# EAGLE design PiZeroAudio (EAGLE 9.1.3)
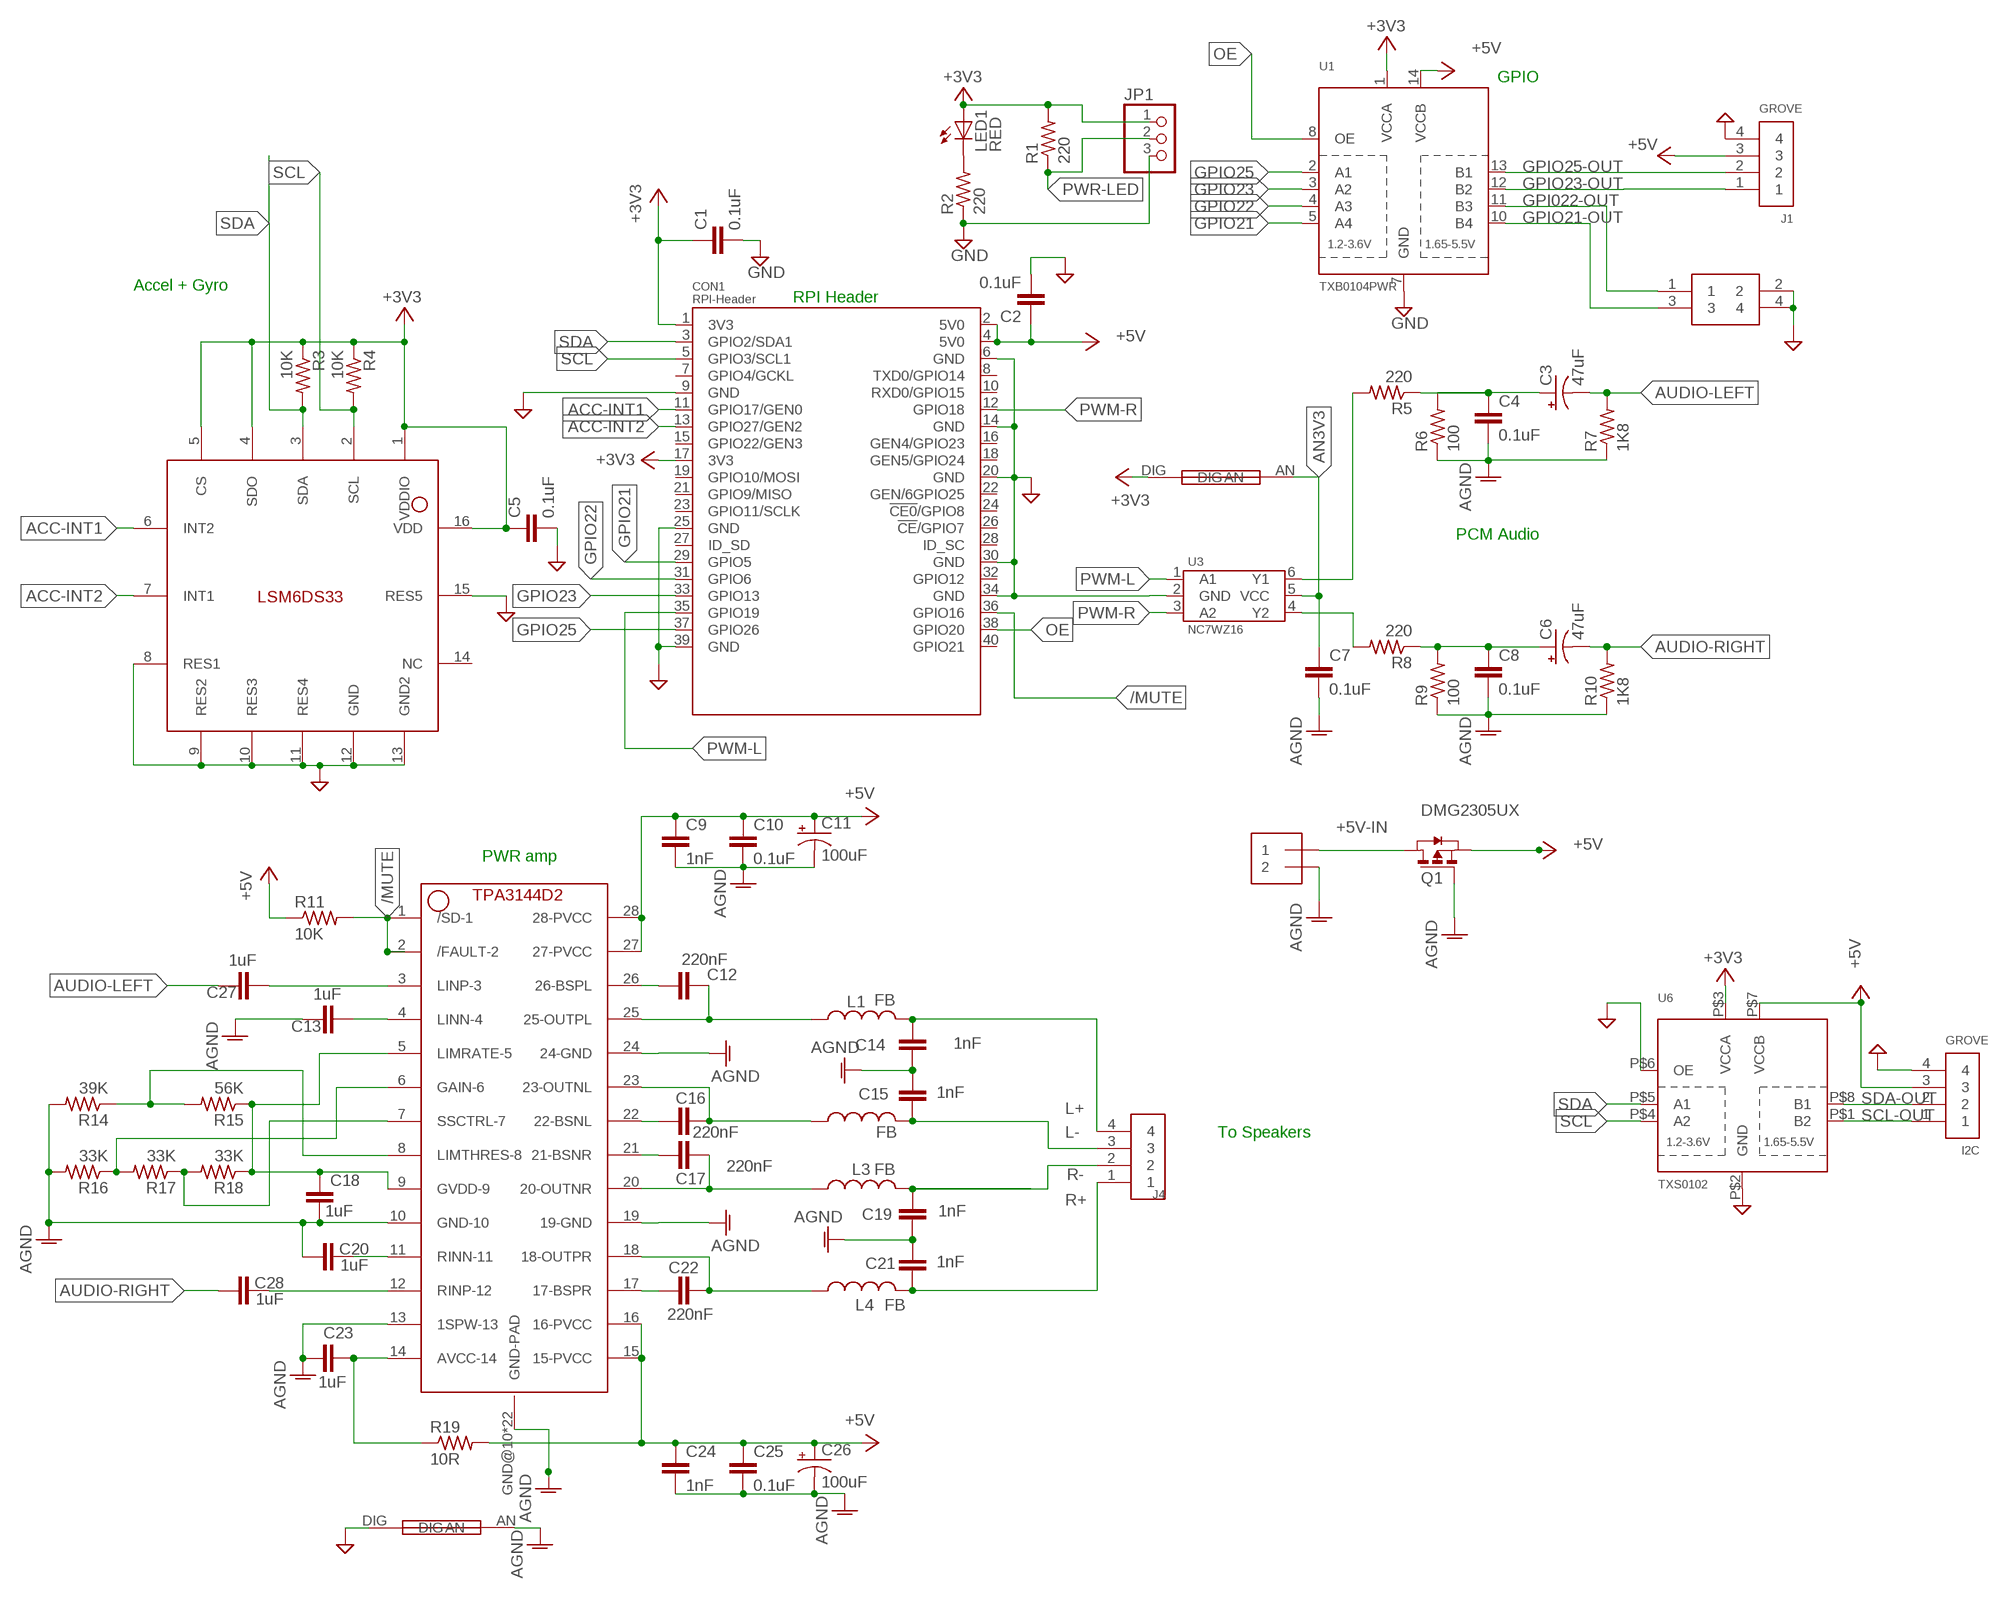
[diagram p0: schematic, sheet 1]

## Parts
C1  0.1uF  C-EUC0603  [C0603]
C2  0.1uF  C-EUC0603  [C0603]
C3  47uF  CAP-POLARISED1206-POLAR  [EIA3216]
C4  0.1uF  C-EUC0603  [C0603]
C5  0.1uF  C-EUC0603  [C0603]
C6  47uF  CAP-POLARISED1206-POLAR  [EIA3216]
C7  0.1uF  C-EUC0603  [C0603]
C8  0.1uF  C-EUC0603  [C0603]
C9  1nF  C-EUC0603  [C0603]
C10  0.1uF  C-EUC0603  [C0603]
C11  100uF  CAP-POLARISED1206-POLAR  [EIA3216]
C12  220nF  C-EUC0603  [C0603]
C13  1uF  C-EUC0603  [C0603]
C14  1nF  C-EUC0603  [C0603]
C15  1nF  C-EUC0603  [C0603]
C16  220nF  C-EUC0603  [C0603]
C17  220nF  C-EUC0603  [C0603]
C18  1uF  C-EUC0603  [C0603]
C19  1nF  C-EUC0603  [C0603]
C20  1uF  C-EUC0603  [C0603]
C21  1nF  C-EUC0603  [C0603]
C22  220nF  C-EUC0603  [C0603]
C23  1uF  C-EUC0603  [C0603]
C24  1nF  C-EUC0603  [C0603]
C25  0.1uF  C-EUC0603  [C0603]
C26  100uF  CAP-POLARISED1206-POLAR  [EIA3216]
C27  1uF  C-EUC0603  [C0603]
C28  1uF  C-EUC0603  [C0603]
CON1  RPI-Header  RPI-ZERO  [RASPBERRYPI_BASTELSTUBE_V13_RASPI_BOARD_B+_FULL]
I2C  GROVE  [JST-PH4]
J1  GROVE  [JST-PH4]
J2  2X2HEADER  [2X2]
J3  2X1-LOCKING  [22-23-2021]
J4  4X1-LOCKING  [22-23-2041]
JP1  Header 1x3  PINHD-1X3  [1X03]
L1  FB  NFZ2MSML0806  [L0806]
L2  FB  NFZ2MSML0806  [L0806]
L3  FB  NFZ2MSML0806  [L0806]
L4  FB  NFZ2MSML0806  [L0806]
LED1  RED  LEDCHIP-LED0805  [CHIP-LED0805]
Q1  DMG2305UX  [SOT23]
R1  220  R-US_R0603  [R0603]
R2  220  R-US_R0603  [R0603]
R3  10K  R-US_R0603  [R0603]
R4  10K  R-US_R0603  [R0603]
R5  220  R-US_R0603  [R0603]
R6  100  R-US_R0603  [R0603]
R7  1K8  R-US_R0603  [R0603]
R8  220  R-US_R0603  [R0603]
R9  100  R-US_R0603  [R0603]
R10  1K8  R-US_R0603  [R0603]
R11  10K  R-US_R0603  [R0603]
R14  39K  R-US_R0603  [R0603]
R15  56K  R-US_R0603  [R0603]
R16  33K  R-US_R0603  [R0603]
R17  33K  R-US_R0603  [R0603]
R18  33K  R-US_R0603  [R0603]
R19  10R  R-US_R0603  [R0603]
SH1  SHORT  [SHORT]
SH2  SHORT  [SHORT]
U1  TXB0104PWR  [TSSOP14]
U2  LSM6DS33  LSM6DS33LGA-16-3X3  [LGA-16-3X3]
U3  NC7WZ16  [SC-70-6]
U5  TPA3144D2PWPR  [HTSSOP28]
U6  TXS0102  [VFSOP-8]

## Nets
+3V3: C1.1 C5.1 CON1.1(3V3) CON1.17(3V3) JP1.1 LED1.A R1.2 R3.1 R4.1 SH1.DIG U1.1(VCCA) U2.1(VDDIO) U2.4(SDO) U2.5(CS) U2.16(VDD) U6.P$3(VCCA)
+5V: C2.1 C9.1 C10.1 C11.+ C24.1 C25.1 C26.+ CON1.2(5V0) CON1.4(5V0) I2C.3 J1.3 Q1.S R11.1 R19.2 U1.14(VCCB) U5.15(15-PVCC) U5.16(16-PVCC) U5.27(27-PVCC) U5.28(28-PVCC) U6.P$7(VCCB)
+5V-IN: J3.1 Q1.D
/MUTE: CON1.36(GPIO16) R11.2 U5.1(/SD-1) U5.2(/FAULT-2)
ACC-INT1: CON1.11(GPIO17/GEN0) U2.6(INT2)
ACC-INT2: CON1.13(GPIO27/GEN2) U2.7(INT1)
AGND: C4.2 C7.2 C8.2 C9.2 C10.2 C11.- C13.2 C14.2 C15.1 C18.2 C19.2 C20.2 C21.1 C23.2 C24.2 C25.2 C26.- J3.2 Q1.G R6.1 R7.1 R9.1 R10.1 R14.2 R16.2 SH2.AN U5.10(GND-10) U5.13(1SPW-13) U5.19(19-GND) U5.24(24-GND) U5.GND@10(GND-PAD) U5.GND@11(GND-PAD) U5.GND@12(GND-PAD) U5.GND@13(GND-PAD) U5.GND@14(GND-PAD) U5.GND@15(GND-PAD) U5.GND@16(GND-PAD) U5.GND@17(GND-PAD) U5.GND@18(GND-PAD) U5.GND@19(GND-PAD) U5.GND@20(GND-PAD) U5.GND@21(GND-PAD) U5.GND@22(GND-PAD) U5.GND@23(GND-PAD) U5.GND@24(GND-PAD) U5.GND@25(GND-PAD) U5.GND@26(GND-PAD) U5.GND@27(GND-PAD) U5.GND@28(GND-PAD) U5.GND@29(GND-PAD) U5.GND@30(GND-PAD) U5.GND@PAD(GND-PAD)
AN3V3: C7.1 SH1.AN U3.5(VCC)
AUDIO-LEFT: C3.- C27.2 R7.2
AUDIO-RIGHT: C6.- C28.2 R10.2
GND: C1.2 C2.2 C5.2 CON1.6(GND) CON1.9(GND) CON1.14(GND) CON1.20(GND) CON1.25(GND) CON1.30(GND) CON1.34(GND) CON1.39(GND) I2C.4 J1.4 J2.2 J2.4 JP1.3 R2.1 SH2.DIG U1.7(GND) U2.8(RES1) U2.9(RES2) U2.10(RES3) U2.11(RES4) U2.12(GND) U2.13(GND2) U2.15(RES5) U3.2(GND) U6.P$2(GND) U6.P$6(OE)
GPI022-OUT: J2.1 U1.11(B3)
GPIO21: CON1.29(GPIO5) U1.5(A4)
GPIO21-OUT: J2.3 U1.10(B4)
GPIO22: CON1.31(GPIO6) U1.4(A3)
GPIO23: CON1.33(GPIO13) U1.3(A2)
GPIO23-OUT: J1.1 U1.12(B2)
GPIO25: CON1.37(GPIO26) U1.2(A1)
GPIO25-OUT: J1.2 U1.13(B1)
L+: C14.1 J4.4 L1.2
L-: C15.2 J4.3 L2.2
N$1: C3.+ C4.1 R5.1 R6.2
N$2: R5.2 U3.6(Y1)
N$3: R8.2 U3.4(Y2)
N$4: C6.+ C8.1 R8.1 R9.2
N$5: C27.1 U5.3(LINP-3)
N$6: LED1.C R2.2
N$7: C13.1 U5.4(LINN-4)
N$8: C20.1 U5.11(RINN-11)
N$9: C23.1 R19.1 U5.14(AVCC-14)
N$10: C22.2 U5.17(17-BSPR)
N$11: C28.1 U5.12(RINP-12)
N$13: C17.2 U5.21(21-BSNR)
N$16: C16.2 U5.22(22-BSNL)
N$17: C12.2 U5.26(26-BSPL)
N$18: C12.1 L1.1 U5.25(25-OUTPL)
N$19: C16.1 L2.1 U5.23(23-OUTNL)
N$20: C17.1 L3.1 U5.20(20-OUTNR)
N$21: C22.1 L4.1 U5.18(18-OUTPR)
N$23: R16.1 R17.2 U5.6(GAIN-6)
N$24: R17.1 R18.2 U5.7(SSCTRL-7)
N$25: R14.1 R15.2 U5.8(LIMTHRES-8)
N$26: C18.1 R15.1 R18.1 U5.5(LIMRATE-5) U5.9(GVDD-9)
OE: CON1.38(GPIO20) U1.8(OE)
PWM-L: CON1.35(GPIO19) U3.1(A1)
PWM-R: CON1.12(GPIO18) U3.3(A2)
PWR-LED: JP1.2 R1.1
R+: C21.2 J4.1 L4.2
R-: C19.1 J4.2 L3.2
SCL: CON1.5(GPIO3/SCL1) R4.2 U2.2(SCL) U6.P$4(A2)
SCL-OUT: I2C.1 U6.P$1(B2)
SDA: CON1.3(GPIO2/SDA1) R3.2 U2.3(SDA) U6.P$5(A1)
SDA-OUT: I2C.2 U6.P$8(B1)
Unconnected: CON1.7(GPIO4/GCKL) CON1.8(TXD0/GPIO14) CON1.10(RXD0/GPIO15) CON1.15(GPIO22/GEN3) CON1.16(GEN4/GPIO23) CON1.18(GEN5/GPIO24) CON1.19(GPIO10/MOSI) CON1.21(GPIO9/MISO) CON1.22(GEN/6GPIO25) CON1.23(GPIO11/SCLK) CON1.24(!CE0!/GPIO8) CON1.26(!CE!/GPIO7) CON1.27(ID_SD) CON1.28(ID_SC) CON1.32(GPIO12) CON1.40(GPIO21) U2.14(NC)

## Notes on the sheet
- GPIO
- Accel + Gyro | RPI Header
- PCM Audio
- PWR amp
- To Speakers

## Library data of the parts
C1 C2 C4 C5 C7-C10 C12-C25 C27 C28 = rcl:C-EU: CAPACITOR, European symbol; SPICEPREFIX: C
C3 C6 C11 C26 = HappyBrackets:CAP-POLARISED: Polarised capacitor 0603 Footprint
CON1 = RPI-Zero:RPI-ZERO
I2C J1 = HappyBrackets:GROVE
J2 = HappyBrackets:2X2HEADER: 2x2 2.54mm header
J3 = HappyBrackets:2X1-LOCKING: 2x1 Locking Header https://www.molex.com/pdm_docs/sd/022272021_sd.pdf
J4 = HappyBrackets:4X1-LOCKING
JP1 = adafruit:PINHD-1X3: PIN HEADER
L1-L4 = HappyBrackets:NFZ2MSM: Ferrite Bead https://www.digikey.com.au/product-detail/en/murata-electronics-north-america/NFZ2MSM301SN10L/490-14481-1-ND/6606942
LED1 = adafruit:LED: LED OSRAM: - CHIPLED LG R971, LG N971, LY N971, LG Q971, LY Q971, LO R971, LY R971 LH N974, LH R974 LS Q976, LO Q976, LY Q976 LO Q996 - Hyper CHIPLED LW Q18S LB Q993, LB Q99A, LB R99A - SideLED LS A670, LO A670, LY A670, LG A670, LP A670 LB A673, LV A673, LT A673, LW A673 LH A674 LY A675 LS A676, LA A676, LO A676, LY A676, LW A676 LS A679, LY A679, LG A679 - Hyper Micro SIDELED® LS Y876, LA Y876, LO Y876, LY Y876 LT Y87S - SmartLED LW L88C, LW L88S LB L89C, LB L89S, LG L890 LS L89K, LO L89K, LY L89K LS L896, LA L896, LO L896, LY L896 - TOPLED LS T670, LO T670, LY T670, LG T670, LP T670 LSG T670, LSP T670, LSY T670, LOP T670, LYG T670 LG T671, LOG T671, LSG T671 LB T673, LV T673, LT T673, LW T673 LH T674 LS T676, LA T676, LO T676, LY T676, LB T676, LH T676, LSB T676, LW T676 LB T67C, LV T67C, LT T67C, LS T67K, LO T67K, LY T67K, LW E67C LS E67B, LA E67B, LO E67B, LY E67B, LB E67C, LV E67C, LT E67C LW T67C LS T679, LY T679, LG T679 LS T770, LO T770, LY T770, LG T770, LP T770 LB T773, LV T773, LT T773, LW T773 LH T774 LS E675, LA E675, LY E675, LS T675 LS T776, LA T776, LO T776, LY T776, LB T776 LHGB T686 LT T68C, LB T68C - Hyper Mini TOPLED® LB M676 - Mini TOPLED Santana® LG M470 LS M47K, LO M47K, LY M47K Source: http://www.osram.convergy.de/
Q1 = HappyBrackets:DMG2305UX: P-CHANNEL ENHANCEMENT MODE MOSFET This MOSFET is designed to minimize the on-state resistance (RDS(ON)), yet maintain superior switching performance, making it ideal for high efficiency power management applications.
R1-R11 R14-R19 = adafruit:R-US_: RESISTOR, American symbol
SH1 SH2 = HappyBrackets:SHORT: Creates a short so analogue and digital power can have different net names. You will need to approve DRC error checks to use this
U1 = adafruit:TXB0104PWR: 4-Bit Bi-Directional Level Shifter 1.2V-3.6V (VCCA) to 1.65V-5.5V (VCCB) bi-directional level shifter with auto direction sensing. Max data rate - VCCA 1.8V: 20Mbps (50ns), VCCA 3.3V: 100Mbps (10ns) Digikey: 296-21929-1-ND
U2 = HappyBrackets:LSM6DS33: iNEMO inertial module: always-on 3D accelerometer and 3D gyroscope
U3 = fairchild:NC7WZ16
U5 = HappyBrackets:TPA3144D2PWPR: TPA3144D2PWPR 6-W Inductor Free Stereo (BTL) Class-D Audio Amplifier with Ultra Low EMI and AGL
U6 = adafruit:TXS0102: 2-Bit Bi-Directional Level Shifter (I2C, etc.) Designed for I2C devices and has internal pullups. Not to be confused with TXB010x series. 1.2V-3.6V (VCCA) to 1.65V-5.5V (VCCB) bi-directional level shifter with auto direction sensing. Max data rate - 24Mbps (Push Pull), 2Mbps (Open Drain) Digikey: 296-21931-1-ND

## Net classes
0 default: width 0.152 mm, clearance 0.152 mm
2 PWM-LEFT: width 0.305 mm, drill 0.508 mm, clearance 0.508 mm
3 PWM-RIGHT: width 0.305 mm, drill 0.508 mm, clearance 0.508 mm
4 AUDIO-L: width 0.305 mm, drill 0.508 mm, clearance 0.508 mm
5 AUDIO-R: width 0.305 mm, drill 0.508 mm, clearance 0.508 mm
6 +5V: width 0.508 mm, drill 0.508 mm, clearance 0.254 mm

## Board
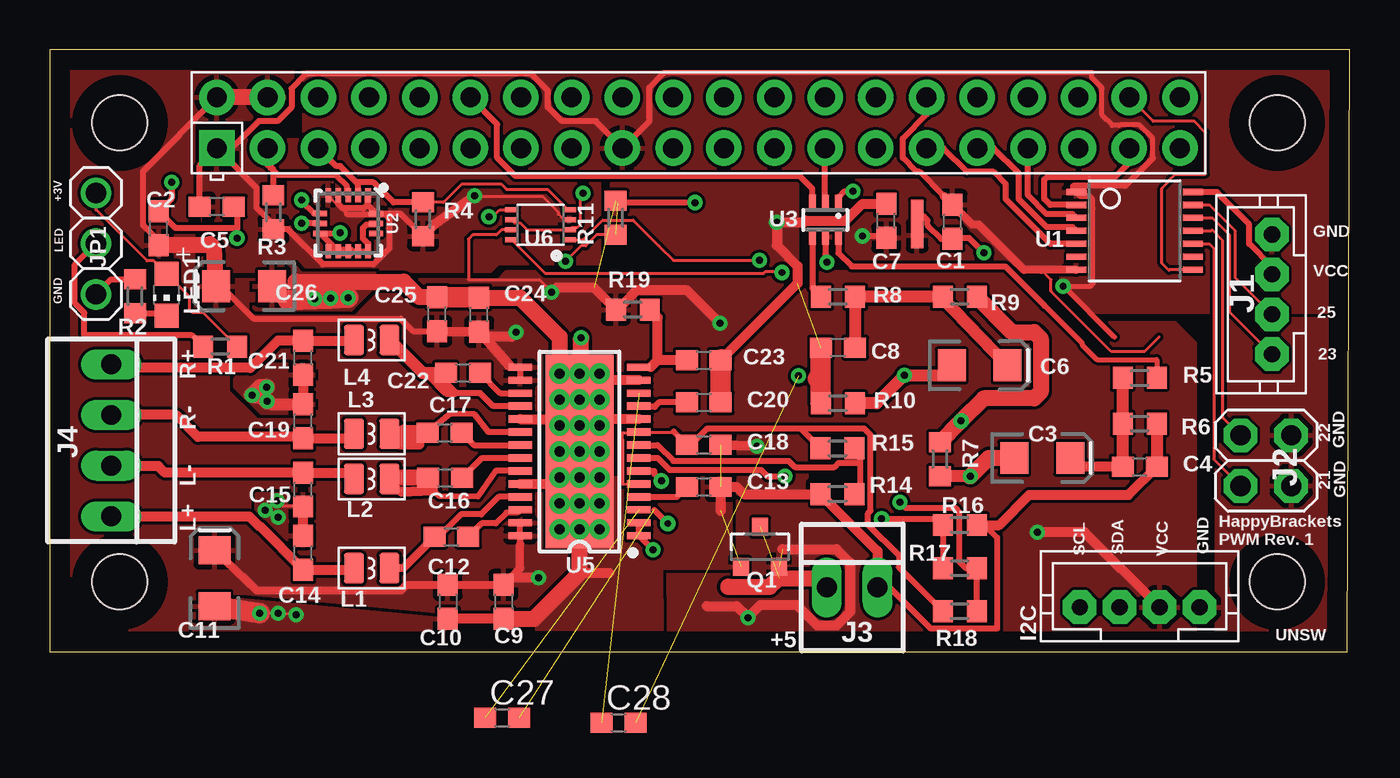
[diagram p1: board, top side]
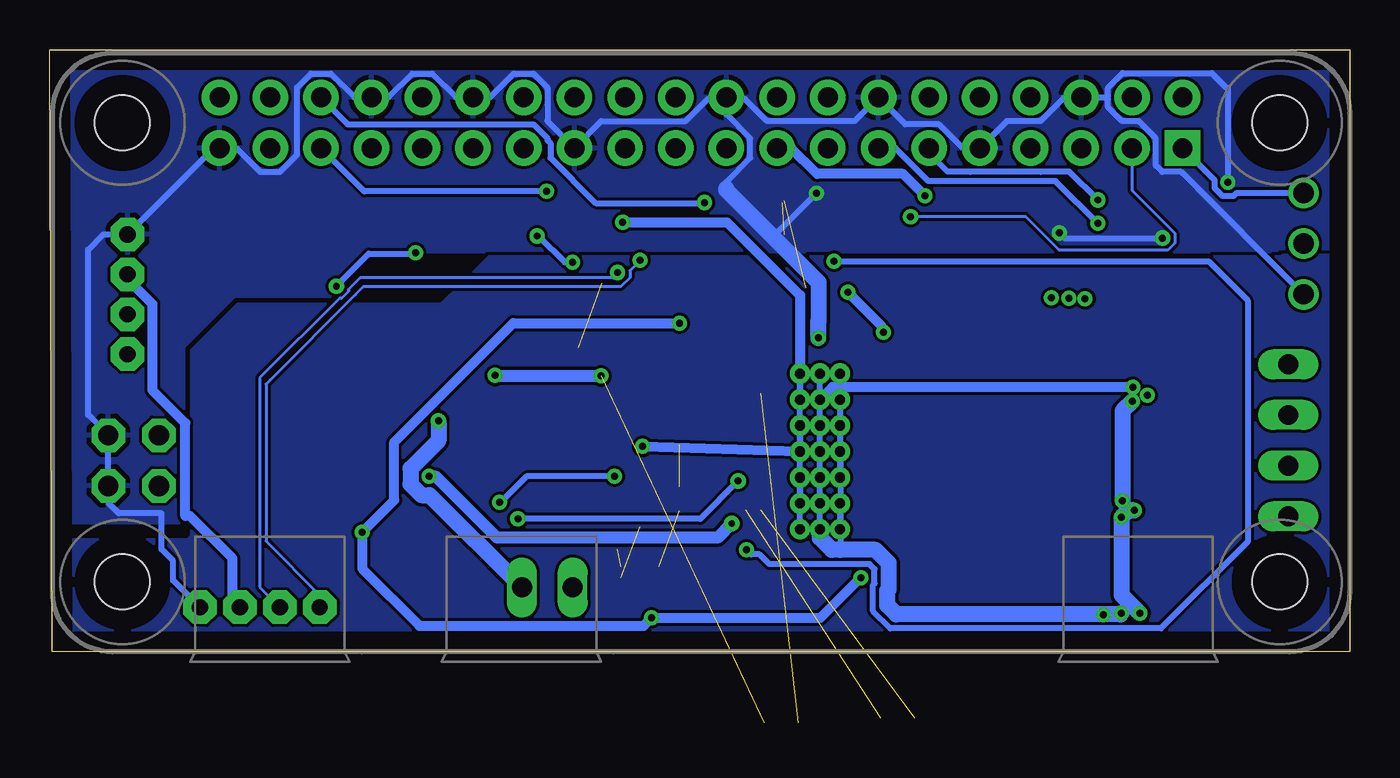
[diagram p2: board, bottom side, seen from below]

Size 65.13 x 30.15 mm. Coordinates in mm from the lower left corner, seen from the top.
Outline: 0,0 65.02,0 65.13,30.15 0,30.15 0,0
Copper layers (1*16): Top 0.035mm / dielectric 1.5mm / Bottom 0.035mm
Design rules "default": minimum track width 6mil, minimum drill 0.35mm, track to track 6mil, track to pad 6mil, pad to pad 6mil, via to via 6mil, smd to smd 6mil, copper to edge 40mil, drill to drill 6mil, minimum pad ring 10mil, minimum via ring 8mil, stop-mask expansion 4mil, vias tented up to drill 0mil, thermal gap 10mil

### Footprints (pad centres in the part's own frame; a part is rotated, then mirrored left to right if it is on the bottom)
C0603 = smd 1.1 x 1: 1 -0.85,0; 2 0.85,0
EIA3216 = smd 1.4 x 1.6: + 1.4,0; - -1.4,0
RASPBERRYPI_BASTELSTUBE_V13_RASPI_BOARD_B+_FULL = drill 1 pad 1.778 square: 1 8.37,25.23 | drill 1 pad 1.778: 2 8.37,27.77; 3 10.91,25.23; 4 10.91,27.77; 5 13.45,25.23; 6 13.45,27.77; 7 15.99,25.23; 8 15.99,27.77; 9 18.53,25.23; 10 18.53,27.77; 11 21.07,25.23; 12 21.07,27.77; 13 23.61,25.23; 14 23.61,27.77; 15 26.15,25.23; 16 26.15,27.77; 17 28.69,25.23; 18 28.69,27.77; 19 31.23,25.23; 20 31.23,27.77; 21 33.77,25.23; 22 33.77,27.77; 23 36.31,25.23; 24 36.31,27.77; 25 38.85,25.23; 26 38.85,27.77; 27 41.39,25.23; 28 41.39,27.77; 29 43.93,25.23; 30 43.93,27.77; 31 46.47,25.23; 32 46.47,27.77; 33 49.01,25.23; 34 49.01,27.77; 35 51.55,25.23; 36 51.55,27.77; 37 54.09,25.23; 38 54.09,27.77; 39 56.63,25.23; 40 56.63,27.77 | hole 2.75: 3.5,3.5; 3.5,26.5; 61.5,3.5; 61.5,26.5
JST-PH4 = drill 0.813 pad 1.676 octagon: 1 -3,0; 2 -1,0; 3 1,0; 4 3,0
2X2 = drill 1.016 pad 1.676 octagon: 1 -3.81,-1.27; 2 -3.81,1.27; 3 -1.27,-1.27; 4 -1.27,1.27
22-23-2021 = drill 1 long: 1 -1.27,0; 2 1.27,0
22-23-2041 = drill 1 long: 1 -3.81,0; 2 -1.27,0; 3 1.27,0; 4 3.81,0
1X03 = drill 1.016: 1 -2.54,0; 2 0,0; 3 2.54,0
L0806 = smd 1.016 x 1.524: 1 -0.889,0; 2 0.889,0
CHIP-LED0805 = smd 1.2 x 1.2: A 0,-1.05; C 0,1.05
SOT23 = smd 0.8 x 0.9: D 0,1; G -0.95,-1; S 0.95,-1
R0603 = smd 1 x 1.1: 1 -0.85,0; 2 0.85,0
SHORT = smd 1.27 x 0.635: AN -0.635,0; DIG 0.508,0
TSSOP14 = smd 0.305 x 0.991: 1 -1.95,-2.918; 2 -1.3,-2.918; 3 -0.65,-2.918; 4 0,-2.918; 5 0.65,-2.918; 6 1.3,-2.918; 7 1.95,-2.918; 8 1.95,2.918; 9 1.3,2.918; 10 0.65,2.918; 11 0,2.918; 12 -0.65,2.918; 13 -1.3,2.918; 14 -1.95,2.918
LGA-16-3X3 = smd 0.7 x 0.28: 1 -1.4,1; 2 -1.4,0.5; 3 -1.4,0; 4 -1.4,-0.5; 5 -1.4,-1; 9 1.4,-1; 10 1.4,-0.5; 11 1.4,0; 12 1.4,0.5; 13 1.4,1 | smd 0.28 x 0.7: 6 -0.5,-1.4; 7 0,-1.4; 8 0.5,-1.4; 14 0.5,1.4; 15 0,1.4; 16 -0.5,1.4
SC-70-6 = smd 0.8 x 0.35: 1 -0.85,0.65; 2 -0.85,0; 3 -0.85,-0.65; 4 0.85,-0.65; 5 0.85,0; 6 0.85,0.65
HTSSOP28 = smd 0.36 x 1.19: 1 -4.225,-2.97; 2 -3.575,-2.97; 3 -2.925,-2.97; 4 -2.275,-2.97; 5 -1.625,-2.97; 6 -0.975,-2.97; 7 -0.325,-2.97; 8 0.325,-2.97; 9 0.975,-2.97; 10 1.625,-2.97; 11 2.275,-2.97; 12 2.925,-2.97; 13 3.575,-2.97; 14 4.225,-2.97; 15 4.225,2.97; 16 3.575,2.97; 17 2.925,2.97; 18 2.275,2.97; 19 1.625,2.97; 20 0.975,2.97; 21 0.325,2.97; 22 -0.325,2.97; 23 -0.975,2.97; 24 -1.625,2.97; 25 -2.275,2.97; 26 -2.925,2.97; 27 -3.575,2.97; 28 -4.225,2.97 | drill 0.508: GND@10 -3.9,1; GND@11 -3.9,0; GND@12 -3.9,-1; GND@13 -2.6,-1; GND@14 -2.6,0; GND@15 -2.6,1; GND@16 -1.3,1; GND@17 -1.3,0; GND@18 -1.3,-1; GND@19 0,-1; GND@20 0,0; GND@21 0,1; GND@22 1.3,1; GND@23 1.3,0; GND@24 1.3,-1; GND@25 2.6,-1; GND@26 2.6,0; GND@27 2.6,1; GND@28 3.9,1; GND@29 3.9,0; GND@30 3.9,-1 | smd 9.7 x 3.4: GND@PAD 0,0
VFSOP-8 = smd 0.25 x 0.65: P$1 -0.75,-1.45; P$2 -0.25,-1.45; P$3 0.25,-1.45; P$4 0.75,-1.45; P$5 0.75,1.45; P$6 0.25,1.45; P$7 -0.25,1.45; P$8 -0.75,1.45

### Placement (x,y rotation side)
C1  45.24,21.54 90 top
C2  5.46,21.21 90 top
C3  49.73,9.71 0 top
C4  54.61,9.27 0 top
C5  8.36,22.3 0 top
C6  46.59,14.35 0 top
C7  41.91,21.59 90 top
C8  39.5,15.24 180 top
C9  22.73,2.5 270 top
C10  19.94,2.5 270 top
C11  8.25,3.68 90 top
C12  20.12,5.77 0 top
C13  32.77,8.26 0 top
C14  12.7,4.95 90 top
C15  12.7,8.13 90 top
C16  19.81,8.71 0 top
C17  19.79,10.97 0 top
C18  32.77,10.37 0 top
C19  12.7,11.56 90 top
C20  32.77,12.49 0 top
C21  12.7,14.73 90 top
C22  20.7,13.97 0 top
C23  32.77,14.6 0 top
C24  21.51,16.89 90 top
C25  19.41,16.92 90 top
C26  9.73,18.31 180 top
C27  22.66,-3.3 0 top  (outside the outline)
C28  28.5,-3.56 0 top  (outside the outline)
CON1  0,0 0 top
I2C  54.61,2.24 0 top
J1  61.24,17.91 90 top
J2  60.93,7.04 270 top
J3  40.21,3.23 0 top
J4  3.07,10.59 270 top
JP1  2.31,20.45 270 top
L1  16.13,4.19 180 top
L2  16.13,8.66 180 top
L3  16.13,10.92 180 top
L4  16.13,15.62 180 top
LED1  5.84,17.88 180 top
Q1  35.59,5.26 0 top
R1  8.53,15.29 0 top
R2  4.27,17.81 270 top
R3  11.2,22.02 90 top
R4  18.69,21.67 90 top
R5  54.61,13.72 0 top
R6  54.61,11.43 180 top
R7  44.6,9.65 270 top
R8  39.5,17.78 180 top
R9  45.59,17.78 180 top
R10  39.5,12.45 0 top
R11  28.35,21.74 270 top
R14  39.47,7.9 180 top
R15  39.47,10.19 0 top
R16  45.59,6.35 0 top
R17  45.59,4.19 180 top
R18  45.59,2.03 0 top
R19  29.21,17.14 180 top
SH1  43.46,21.49 90 top
SH2  26.49,13.84 90 top
U1  54.36,21.08 270 top
U2  14.95,21.46 270 top
U3  38.86,21.64 270 top
U5  26.54,10.03 90 top
U6  24.59,21.39 90 top

### Tracks (layer width: path | path; a pad name or v marks a point on that pad's centre or on a via)
+3V3  (via drill 0.35)
  Top 0.152: U2.5 14.36,22.45 14.43,22.45 | U2.4 14.45,22.36 14.89,21.92 | R1.2 7.69,16.98 7.13,16.98 7,17.12 7,17.78 LED1.A 5.19,19.58 4.87,19.58 2.31,22.14 JP1.1 | v21.28,22.84 21.31,22.81 24.69,22.81 25.48,22.01 25.48,21.92 25.76,21.64 U6.P$3
  Top 0.254: v50.77,18.31 50.8,18.31 | 50.8,18.31 52.15,18.31 52.27,18.44 52.27,22.2 52.24,22.23 | 53.35,15.76 50.8,18.31 | 55.28,24.74 55.26,24.76 55.26,25.71 54.57,26.4 53.61,26.4 53.57,26.37 53.24,26.37 52.72,26.89 52.72,28.25 52.22,28.75 52.22,29.01 30.78,29.01 30.74,28.96
  Top 0.305: 14.43,22.45 14.68,22.21 15.71,22.21 15.9,22.4 15.9,22.82 U2.1 15.95,22.36 U2.16 17.55,21.96 R4.1 | C5.1 7.51,24.37 CON1.1 8.51,25.09 | 8.51,25.09 10.35,23.25 10.35,22.25 11.2,21.39 R3.1 11.92,21.17 13.68,19.41 16.21,19.41 17,20.2 17,21.73 16.81,21.92 14.89,21.92 | 52.24,22.23 52.24,22.66 52.06,22.84 51.63,22.84 U1.1 51.28,23.19 51.28,23.34 53.89,23.34 55.28,24.74 | v46.81,19.99 46.07,20.73 45.27,20.73 | 8.51,25.09 8.99,25.09 10.47,26.58 11.4,26.58 12.1,27.28 12.1,28.21 12.83,28.93 12.92,28.93 12.96,28.96 24.1,28.96 24.96,28.11 24.96,27.28 25.66,26.58 27.34,26.58 CON1.17 30.04,26.58 30.04,28.26 30.74,28.96 | C1.1 45.27,20.73 | 45.27,20.73 C1.1 | C1.1 44.66,20.69 43.98,21.37 43.98,21.62 43.8,21.79 43.66,21.79 SH1.DIG | 14.43,22.45
  Top 0.508: v21.28,22.84 19.31,21.44 R4.1
  Bottom 0.305: v50.77,18.31 49.15,19.94 46.81,19.94 v46.81,19.99 | CON1.1 6.78,23.64 6.78,23.24 6.38,22.84 5.81,22.84 5.66,22.99 JP1.1
  Bottom 0.508: v21.28,22.84 22.38,23.93 26.69,23.93 27.98,25.23 CON1.17
  pour Top: 12.7,30.48 12.7,24.13 58.42,24.13 58.42,29.21 58.42,30.48 13.97,30.48
  pour Top (rank 2): 7.62,25.4 7.62,19.05 22.1,19.05 22.48,19.43 27.56,19.43 27.56,25.15 27.05,25.65 7.87,25.65
  pour Top (rank 2): 48.13,29.97 48.13,23.11 47.62,22.61 47.62,20.07 47.88,19.81 49.53,19.81 52.32,17.02 65.28,17.02 65.91,17.65 65.91,30.23 65.53,30.61 48.39,30.61 48.26,30.48
+5V  (via drill 0.35)  (2 unrouted)
  Top 0.152: U6.P$7 22.63,21.14 22.37,20.88 21.19,20.88 20.98,20.68 20.98,18.64 24.54,18.64 25.17,18.01
  Top 0.305: C26.+ 8.6,18.31 10.22,16.69 17.58,16.69 18.2,16.07 C25.1 | J1.3 61.24,19.29 60.1,20.43 60.1,21.41 58.48,23.03 58.24,23.03 U1.14 | C2.1 5.46,20.58 4.66,21.38 4.66,24.06 CON1.2 | 23.04,14.33 23.1,14.26 U5.15 U5.16 | U5.27 23.57,5.41 U5.28
  Top 0.406: C11.+ 10.36,3.07 17.6,3.07 17.88,3.35 C10.1 C9.1 23.08,3.69 23.57,4.19 23.57,5.41
  Top 0.508: C25.1 C24.1 21.75,15.77 | 21.75,15.77 23.04,14.33 | R19.2 28.06,17.44 | 28.06,17.44 27.27,18.24 25.4,18.24 25.17,18.01 v25.15,18.01 | v23.37,16 23.14,15.77 21.75,15.77 | 32.92,2.29 34.42,2.29 34.98,1.73 | 34.98,1.73 v34.98,1.7 | v24.49,3.71 23.09,3.71 23.08,3.69 | 34.98,1.73 35.58,2.34 37.43,2.34 38.46,1.31 39.42,1.31 40.1,1.99 40.1,4.46 39.42,5.14 36.7,5.14 | 28.06,17.44 28.73,17.44 29.39,18.1 31.94,18.1 v33.58,16.46 | I2C.3 51.85,5.99 v49.48,5.99
  Top 0.813: CON1.4 CON1.2 | C26.+ 8.23,20.22 8.03,20.42 7.96,20.36 C2.1
  Bottom 0.508: v25.15,18.01 23.47,16.33 23.47,16.08 23.39,16 v23.37,16 | v24.49,3.71 24.51,3.71 26.52,1.7 v34.98,1.7 35.38,1.29 46.61,1.29 49.48,4.17 v49.48,5.99 47.88,7.6 47.88,10.5 41.92,16.46 v33.58,16.46 | J1.3 61.24,18.67 59.99,17.42 59.99,13.11 58.34,11.46 58.34,6.81 58.11,6.81 55.98,4.67 55.98,2.61 I2C.3
  pour Top (rank 2): 2.16,18.67 22.48,18.67 22.86,19.05 48.26,19.05 49.53,19.05 52.07,16.51 56.39,16.51 57.4,15.49 57.4,-1.02 57.15,-1.27 0,-1.27 -1.27,0 -1.27,16.51 0,16.51
  pour Top (rank 2): 7.62,26.67 11.68,26.67 12.19,27.18 12.19,30.48 -1.27,30.48 -1.27,16.89 -0.76,16.38 6.98,16.38 7.24,16.64 7.24,26.54 7.11,26.67 7.37,26.67 7.49,26.54
  pour Top (rank 2): 27.94,19.05 27.94,23.37 28.12,23.55 35.89,23.55 36.19,23.24 36.32,23.11 36.32,22.23 39.37,19.18 39.37,18.8 28.19,18.8
+5V-IN  (1 unrouted)
  Top 0.305: 36.53,3.72 36.5,3.68
  Top 0.813: 33.99,3.26 34,3.25 36.07,3.25 36.5,3.68 38.48,3.68 J3.1
/MUTE  (via drill 0.35)  (1 unrouted)
  Top 0.152: R11.2 27.4,20.89 26.84,20.33 26.61,20.33 v25.83,19.56
  Top 0.305: v32.33,22.5 28.43,22.5 | U5.1 29.51,5.89 | 29.51,5.89 U5.2 | v30.23,5.11 U5.1 29.51,5.89
  Bottom 0.305: CON1.36 50.2,26.42 40.9,26.42 40.2,25.72 40.2,25.63 40.04,25.48 40.04,24.74 37.79,22.48 32.33,22.48 v32.33,22.5 | v30.23,5.11 30,4.88 29.57,4.88 29.08,4.39 24.05,4.39 23.8,4.14 23.8,3.43 23.88,3.35 23.88,2.03 23.01,1.17 9.45,1.17 5.1,5.51 5.1,17.6 7.06,19.56 v25.83,19.56
ACC-INT1  (via drill 0.35)
  Top 0.305: U2.6 13.24,21.96 12.65,22.55 12.65,22.61 v12.62,22.63
  Bottom 0.305: v12.62,22.63 14.05,24.05 15.48,24.05 15.5,24.04 19.02,24.04 19.04,24.05 20.14,24.05 21.07,24.98 CON1.11
ACC-INT2  (via drill 0.35)
  Top 0.305: U2.7 v12.62,21.46
  Bottom 0.305: CON1.13 22.76,25.23 21.11,23.58 14.74,23.58 v12.62,21.46
AGND  (via drill 0.35)  (3 unrouted)
  Top 0.152: U5.GND@PAD U5.GND@14 | U5.GND@28 25.63,13.93 26.08,13.49 26.54,13.49 26.54,13.41 U5.GND@PAD | SH2.AN U5.GND@25 | U5.GND@PAD U5.GND@24 | U5.GND@PAD U5.GND@22 | U5.GND@PAD 28.14,11.63 28.14,11.66 | C26.- 12.06,18.31 12.29,18.54 | C15.1 11.67,7.28 v11.38,7.57 11.28,7.57 v10.8,7.09 | v12.34,1.85 v11.43,1.93 v10.52,1.93
  Top 0.305: J3.2 42.07,3.23 44.13,1.17 47.47,1.17 47.47,5.71 46.84,6.35 | U5.GND@PAD U5.GND@10 | U5.GND@PAD U5.GND@11 | U5.GND@PAD 26.54,13.41 U5.GND@PAD | v13.26,17.68 14.01,17.68 14.02,17.69 | v14.07,17.7 14.91,17.7 v14.93,17.73 | C26.- 12.06,18.31
  Top 0.508: 11.93,17.61 arc-90 C26.- | 21.49,17.77 C24.2 | C9.2 C10.2 | C14.2 C15.1 | C21.1 C19.2 | U5.10 28.14,11.66 | U5.13 27.87,13.61 U5.GND@30 | U5.24 25.22,8.41 U5.GND@16 | U5.19 25.22,11.66 U5.GND@22 | R10.1 38.6,12.49 38.65,12.53 38.65,12.95 | 28.03,3.94 26.54,3.94 | R16.2 46.84,6.35 47.57,6.35 49.08,7.86 54.05,7.86 C4.2 | 33.62,7.06 C13.2 34.42,8.26 34.77,7.9 R14.2 41.48,5.04 J3.2 | C7.2 40.72,22.44 39.88,21.6 37.87,21.6 37.78,21.51 v36.42,21.51 36.42,20.36 37.46,19.32 37.46,18.45 C23.2 | C18.2 35.31,10.31 v35.43,10.29
  Top 0.61: v10.9,12.55 11.04,12.41 C19.2 | R6.1 C4.2
  Top 0.813: C24.2 23.56,17.74 25.54,15.76 25.54,14.77 25.53,14.75 25.53,13.95 U5.GND@28 | C9.2 24.26,1.65 26.54,3.94 U5.GND@11 | C25.2 18.5,17.77 17.73,18.54 12.29,18.54 | R9.1 48.21,16.01 49.32,16.01 49.65,15.68 49.65,13.02 49.32,12.69 46.79,12.69 v45.66,11.56 | R7.1 v45.66,11.56 | v45.66,11.56 | C8.2 38.65,13.77 38.65,12.95 | v10.87,13.26 10.54,13.26 v10.13,12.85 10.59,12.85 v10.9,12.55
  Top 1.016: v14.93,17.73 14.02,17.69 11.93,17.61 | C20.2 33.62,13.67 C23.2 33.67,14.66 | C8.2 38.6,15.2 38.6,13.54 | 38.6,13.54 38.6,12.49 | 38.48,13.67 38.6,13.54 | C25.2 21.49,17.77 | v10.52,1.93 C11.-
  Bottom 0.305: 25.53,5.11 U5.GND@28 U5.GND@29 U5.GND@11 | U5.GND@30 U5.GND@25 U5.GND@26 U5.GND@27 U5.GND@22 U5.GND@23 U5.GND@24 U5.GND@19 U5.GND@PAD U5.GND@21 U5.GND@16 U5.GND@17 U5.GND@18 U5.GND@13 U5.GND@14 U5.GND@15 U5.GND@10 U5.GND@12 U5.GND@30
  Bottom 0.508: U5.GND@30 27.54,17.87 31.19,21.51 v36.42,21.51 | v10.87,13.26 25.92,13.26 U5.GND@26 | v35.43,10.29 U5.GND@19
  Bottom 0.813: v45.66,11.56 45.66,10.58 47.06,9.18 47.06,8.4 46.51,7.85 46.1,7.85 J3.2 | v10.9,12.55 11.38,12.07 v11.38,7.57 | v10.8,7.09 11.07,7.09 v11.43,6.73 11.43,2.85 v10.52,1.93 | v11.43,1.93 11.48,1.88 22.72,1.88 23.16,2.33 23.16,3.06 23.09,3.13 23.09,4.44 23.76,5.11 25.53,5.11 25.94,5.11 26.54,5.71 U5.GND@11
  pour Top: 10.21,19.38 10.21,17.17 10.24,17.14 15.14,17.14 15.39,17.4 16.18,18.19 16.31,18.19 16.31,18.97 13,18.97 12.65,18.97 12.24,19.38
  pour Top: 9.25,13.67 9.25,13.26 10.41,12.09 10.57,11.94 13.23,11.94 13.23,14.4 9.98,14.4
  pour Top: 10.41,6.96 12.06,5.31 13.13,5.31 13.13,7.8 13.13,7.92 10.34,7.92 10.31,7.9 10.31,7.06
  pour Top: 19.74,1.66 9.42,2.64 7.19,2.62 7.19,1.07 19.79,1.07
  pour Top: 34.34,10.85 37.95,10.85 37.95,7.9 34.32,7.87 34.32,10.85
  pour Top: 24.36,1.12 30.71,1.09 30.68,4.19 34.16,4.19 34.16,8.71 26.49,8.71 26.54,3.68 24.36,1.4
  pour Top: 37.46,23.44 37.46,19.33 28.14,19.33 28.14,23.5 37.46,23.5 37.46,23.47
AN3V3  (via drill 0.35)
  Top 0.305: U3.5 38.86,19.91 38.94,19.84 v38.94,19.51 | v40.72,20.83 41.82,20.83 C7.1
  Bottom 0.305: v38.94,19.51 39.32,19.51 40.61,20.8 40.69,20.8 v40.72,20.83
  pour Top (rank 2): 36.83,22.86 40.26,19.43 46.74,19.43 46.99,19.68 46.99,22.48 46.99,22.86 46.23,23.62 37.59,23.62
ANGND
  pour Bottom: 0.84,19.86 3.36,19.86 3.44,19.79 43.15,19.79 44.53,18.41 45.54,17.4 55.75,17.4 58.04,15.11 58.04,5.82 58.24,5.61 64.57,5.61 64.57,0.28 0.84,-0.44
AUDIO-LEFT  (via drill 0.35)  (1 unrouted)
  Top 0.305: 30.28,7.11 30.73,6.65 v30.96,6.43
  Top 0.61: v46.13,8.79 46.11,8.8 R7.2
  Top 0.813: v46.13,8.79 47.05,9.71 C3.-
  Bottom 0.61: v30.96,6.43 31.67,5.71 31.8,5.71 42.72,5.71 45.77,8.76 46.1,8.76 v46.13,8.79
AUDIO-RIGHT  (via drill 0.35)  (1 unrouted)
  Top 0.61: C6.- 44.58,13.84 v42.82,13.84 41.43,12.45 R10.2
  Bottom 0.61: v42.82,13.84 42.8,13.84 42.77,13.82 v37.52,13.82
GND  (via drill 0.35)
  Top 0.152: v26.72,22.96 26.59,22.83 26.59,21.42 26.43,21.26 26.16,21.26 U6.P$2 23.91,21.14 23.56,21.49 23.28,21.49 U6.P$6 | 49.68,19.13 50.17,18.65 50.17,18.06 53.2,15.03 54.85,15.03 55.58,15.76
  Top 0.305: 15.39,20.06 15.06,20.06 U2.11 15.39,20.06 | 15.39,20.06 U2.13 | U2.15 16.29,21.41 15.87,21.41 15.69,21.23 15.69,20.7 15.95,20.44 U2.13 | U3.2 38.85,22.5 CON1.25 | CON1.30 43.93,26.92 42.74,25.72 42.74,24.74 43.44,24.04 43.59,24.04 44.79,22.84 C1.2 | 9.4,21.23 6.29,21.23 C2.2 6.1,22.69 v6.1,23.52 | 9.4,21.23 9.4,22.12 C5.2 | U2.9 U2.10 U2.8 14.47,20.96 14.48,20.96 14.53,20.96 v14.55,20.98 | U2.12 U2.13 | v9.37,20.73 9.37,21.21 9.4,21.23 | JP1.3 3.06,18.66 R2.1
  Top 0.406: 44.79,22.84 46.23,21.4 46.55,21.4 48.82,19.13 49.68,19.13 U1.7
  Top 0.508: U2.10 15.06,20.06
  Top 0.813: v26.62,15.72 26.62,14.48 26.59,14.45 SH2.DIG
  Bottom 0.305: 31.23,23.22 31.23,23.54 30.04,24.74 30.04,25.72 31.23,26.92 31.23,27.69 | 31.23,27.69 CON1.20 | 31.23,27.69 30.29,27.69 29.18,26.58 24.8,26.58 CON1.14 22.26,26.42 20.58,26.42 19.38,25.23 CON1.9 17.18,26.58 15.5,26.58 14.3,27.77 CON1.6 12.21,27.77 | 31.23,27.69 32.17,27.69 33.28,26.58 37.5,26.58 CON1.25 40.2,26.58 40.2,28.26 40.9,28.96 41.88,28.96 43.08,27.77 CON1.30 44.78,27.77 45.98,28.96 46.96,28.96 48.16,27.77 CON1.34 49.86,27.77 51.06,28.96 52.04,28.96 52.74,28.26 52.74,24.89 53.6,24.04 54.58,24.04 55.78,25.23 CON1.39 56.92,25.23 J1.4 62.46,20.91 63.22,20.14 63.22,11.86 J2.2 J2.4 62.2,7.47 61.67,6.93 59.54,6.93 59.54,5.13 58.96,4.55 58.96,3.58 I2C.4 | v14.55,20.98 14.3,20.73 v9.37,20.73 | 12.21,27.77 12.1,27.88 12.1,28.26 11.39,28.98 6.91,28.98 6.1,28.17 v6.1,23.52 | v26.72,22.96 28.82,20.87 28.97,20.87 | 12.21,27.77 12.17,27.77 12.1,27.7 12.1,27.28 11.4,26.58 10.57,26.58 9.72,25.72 9.72,24.37 9.38,24.04 8.44,24.04 JP1.3
  Bottom 0.813: v26.62,15.72 26.62,16.54 26.59,16.56 | 26.59,16.56 26.59,18.49 28.97,20.87 31.23,23.13 31.23,23.22 | 26.59,16.56
  pour Bottom (rank 2): -1.75,30.48 -1.75,19.99 47.29,20.02 48.26,19.05 49.53,17.78 55.88,17.78 57.15,16.51 58.42,15.24 58.42,6.43 65.68,6.43 65.68,30.48
  pour Top: 47.35,19.76 47.35,19.35 51.66,19.35 51.66,23.72 43.89,23.72
  pour Top (rank 3): 58.42,16.51 58.42,0.1 64.72,0.1 64.72,23.24 58.42,23.24
GPI022-OUT
  Top 0.152: U1.11 58.19,21.08 58.24,21.13 58.75,20.62 58.75,11.76 J2.1
GPIO21
  Top 0.305: U1.5 50.14,20.43 47.9,22.67 47.9,23.43 47.3,24.04 45.98,24.04 44.78,25.23 CON1.29
GPIO21-OUT
  Top 0.152: U1.10 58.1,20.43 58.32,20.22 58.32,9.65 J2.3
GPIO22
  Top 0.305: CON1.31 47.29,25.23 48.55,23.97 48.55,22.67 49.95,21.28 51.24,21.28 U1.4
GPIO23
  Top 0.305: U1.3 51.24,21.93 49.95,21.93 49.01,22.86 CON1.33
GPIO23-OUT
  Top 0.152: U1.12 58.25,21.73 59.11,20.88 59.11,17.04 J1.1
GPIO25
  Top 0.305: U1.2 50.13,22.38 49.83,22.68 49.83,23.65 49.99,23.8 53.39,23.8 54.09,24.5 CON1.37
GPIO25-OUT
  Top 0.152: J1.2 59.41,18.74 59.41,21.08 58.11,22.38 U1.13
L+
  Top 0.508: J4.4 9.99,6.78 10.47,6.3 10.5,6.3 C14.1 15.15,4.1 L1.2
L-
  Top 0.508: J4.3 3.1,9.3 5.44,9.3 5.75,8.98 C15.2 14.92,8.98 L2.2
N$1
  Top 0.508: C4.1 51.67,9.27 C3.+
  Top 0.61: C4.1 R6.2 R5.1
N$2
  Top 0.254: 49.86,17.32 51.71,15.47 51.71,15.39 52.48,14.63 55.46,14.63 R5.2
  Top 0.305: 49.86,17.32 47.88,19.3 40.18,19.3 39.51,19.98 U3.6
N$3
  Top 0.305: R8.2 38.21,18.21 U3.4
N$4
  Top 0.61: R9.2 44.42,17.78 | 44.42,17.78 R8.1 C8.1 | C6.+ 44.66,17.78 44.42,17.78
N$5  (1 unrouted)
N$6
  Top 0.305: R2.2 5.72,16.96 LED1.C
N$7
  Top 0.305: U5.4 31.42,7.76 C13.1
N$8
  Top 0.305: C20.1 30.52,12.49 30.3,12.27 29.55,12.27 U5.11
N$9
  Top 0.305: U5.14 30.11,14.26
  Top 0.508: C23.1 30.45,14.61 | 30.45,14.61 30.45,16.75 R19.1 | 30.11,14.26 30.45,14.61
N$10
  Top 0.305: C22.2 22.56,12.96 U5.17
N$11  (1 unrouted)
N$13
  Top 0.305: C17.2 21.25,10.36 U5.21
N$16
  Top 0.305: C16.2 21.66,9.71 U5.22
N$17
  Top 0.305: U5.26 23.43,6.97 22.87,6.97 22.33,6.43 21.63,6.43 C12.2
N$18
  Top 0.305: U5.25 22.49,7.76 21.61,6.88 20.6,6.88 19.49,5.77 C12.1
  Top 0.406: C12.1 17.69,4.19 L1.1
N$19
  Top 0.305: U5.23 22.34,9.06 21.44,7.77 19.53,7.8 19.18,8.1 18.73,8.48 | L2.1 17.6,8.03
  Top 0.508: 17.6,8.03 19.18,8.1
  Top 0.61: 18.73,8.48 C16.1
  Top 0.813: C16.1 17.07,8.71 L2.1
N$20
  Top 0.305: U5.20 21.98,11.01 21.28,11.89 20.07,11.91 19.35,11.35 C17.1
  Top 0.508: L3.1 17.53,10.39 18.52,10.39 17.75,10.97
  Top 0.813: 17.75,10.97 C17.1
N$21
  Top 0.305: U5.18 22.21,12.31 21.56,12.95 20.29,12.95 20.27,12.98
  Top 0.406: 18.87,13.97 19.86,12.98 20.27,12.98 | 20.29,12.95 19.85,13.4 C22.1
  Top 0.61: L4.1 18.67,13.97 18.87,13.97 C22.1
N$23  (via drill 0.35)
  Top 0.305: U5.6 30.27,9.06 30.28,9.07 30.28,8.92 v30.64,8.56 | v41.68,6.65 44.44,6.65 R16.1 R17.2
  Bottom 0.305: v30.64,8.56 32.54,6.65 v41.68,6.65
N$24  (via drill 0.35)
  Top 0.305: R18.2 R17.1 45.9,4.19 45.55,4.54 45.55,7.03 45.37,7.21 42.88,7.21 v42.6,7.49 | U5.7 30.45,9.71 31.05,9.11 35.64,9.11 35.97,8.79 v36.83,8.79
  Bottom 0.305: v36.83,8.79 41.25,8.79 42.47,7.57 42.52,7.57 v42.6,7.49
N$25
  Top 0.305: 40.6,9.4 40.6,9.91 R15.2 | 40.6,9.4 40.6,8.18 R14.1 | U5.8 30.45,10.36 31.24,9.57 37.02,9.57 37.34,9.25 39.3,9.25 39.52,9.46 40.54,9.46 40.6,9.4
N$26
  Top 0.152: U5.5 28.7,8.38 28.7,8.77 28.69,8.78 28.69,10.63 28.7,10.64 28.7,10.97 29.48,10.97 U5.9 31.25,11.01 31.26,11.02
  Top 0.305: C18.1 31.79,10.5 | 31.26,11.02 31.79,10.5 | 31.79,10.5 32.26,10.5 32.94,11.18 37.63,11.18 | R15.1 37.63,11.18 | 37.63,11.18 40.81,11.18 41.13,10.86 41.13,7.07 41,6.94 41,6.37 42.54,4.83 42.54,4.24 | 42.54,4.24 | 42.54,4.24 R18.1
OE
  Top 0.152: U1.8 56.11,19.13 56.08,19.1 55.73,19.46 55.73,23.22 56.13,23.62 56.13,23.67 56.39,23.93 57.91,23.93 57.91,26.01 57.35,26.57 55.29,26.57 CON1.38
PWM-L  (via drill 0.35)
  Top 0.305: U3.1 39.51,22.77 39.8,23.06 v40.23,23.06
  Bottom 0.305: v40.23,23.06 49.38,23.06 CON1.35
PWM-R
  Top 0.305: CON1.12 22.42,26.42 22.42,24.74 23.33,23.82 37.59,23.82 38.21,23.2 U3.3
PWR-LED
  Top 0.305: R1.1 7.13,15.85 1.73,15.85 1.73,16.98 1.24,17.46 1.24,19.38 JP1.2
R+
  Top 0.508: L4.2 15.2,15.58 C21.2 11.42,15.58 10.06,14.22 3.25,14.22 J4.1
R-
  Top 0.508: J4.2 6.32,11.86 7.42,10.77 12.64,10.77 C19.1 15.02,10.71 L3.2
SCL
  Top 0.152: R4.2 19.73,22.52 20.66,23.44 22.6,23.44 22.88,23.16 24.94,23.16 25.97,22.14 U6.P$4
  Top 0.305: CON1.5 14.35,24.33 14.55,24.33 15.3,23.58 | 15.3,23.58 15.45,23.43 U2.2 | 15.3,23.58 15.36,23.52 16.21,23.52 17.21,22.52 R4.2
SCL-OUT  (via drill 0.35)
  Top 0.152: U6.P$1 26.72,20.64 27.7,21.62 29.23,21.62 30.53,20.32 31.24,19.61 v35.56,19.61
  Bottom 0.152: v35.56,19.61 36.07,19.09 36.07,18.75 36.53,18.29 37.03,18.29 49.43,18.29 49.83,17.88 54.1,13.61 54.3,13.41 54.3,5.54 51.61,2.84 I2C.1
SDA  (via drill 0.35)
  Top 0.152: v22,21.79 22.2,21.79 22.54,22.14 U6.P$5
  Top 0.305: U2.3 14.89,22.92 14.89,23.34 14.36,23.88 11.43,23.88 11.06,24.24 10.91,24.4 10.91,24.43 | 10.91,24.43 CON1.3 | R3.2 11.2,24.14 10.91,24.43
  Bottom 0.152: CON1.3 10.91,23.12 8.77,20.98 8.77,20.48 9.12,20.12 14.55,20.12 16.22,21.79 v22,21.79
SDA-OUT  (via drill 0.35)
  Top 0.152: 36.73,19.05 v36.68,19 36.73,19.05 | 36.73,19.05 35.86,19.05 35.76,18.95 24.82,18.95 U6.P$8
  Bottom 0.152: v36.68,19 36.93,18.75 49.58,18.75 50.17,18.16 50.17,18.06 50.52,17.71 50.62,17.71 54.61,13.72 54.61,3.23 I2C.2

### Text on the board
tNames: +3V | GND | LED | VCC | GND | 25 | R+ | 23 | R- | 22 | L- | GND | L+ | 21 | GND | SCL | SDA | VCC | GND | HappyBrackets / PWM Rev. 1 | UNSW | +5